# Altium schematic sheet EP600_SENSOR_V1.0.SchDoc
size A4
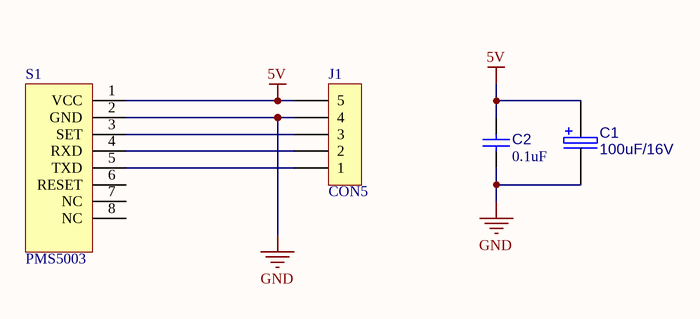
[diagram p0: EP600_SENSOR_V1.0.SchDoc]

## Parts
C1  100uF/16V  [CE06150]
C2  0.1uF  [0805_C]
J1  CON5  [XH2.54-5PZ]
S1  PMS5003  [HEADER1X8 1.27]

## Nets
5V: C1.1(+) C2.2 J1.5 S1.1(VCC)
GND: C1.2(-) C2.1 J1.4 S1.2(GND)
NetJ1_1: J1.1 S1.5(TXD)
NetJ1_2: J1.2 S1.4(RXD)
NetJ1_3: J1.3 S1.3(SET)

Not connected (* = marked no-connect by the designer): S1 6(RESET) 7(NC) 8(NC)

## Library data of the parts
C1 = ECAP: E-CAP
C2 = Cap: Capacitor; Published: 8-Jun-2000; LatestRevisionDate: 17-Jul-2002; LatestRevisionNote: Re-released for DXP Platform.; PackageReference: RAD-0.3; Publisher: Altium Limited
J1 = CON6: Connector